# EAGLE design JBC_Station_V4 (EAGLE 7.7.0)
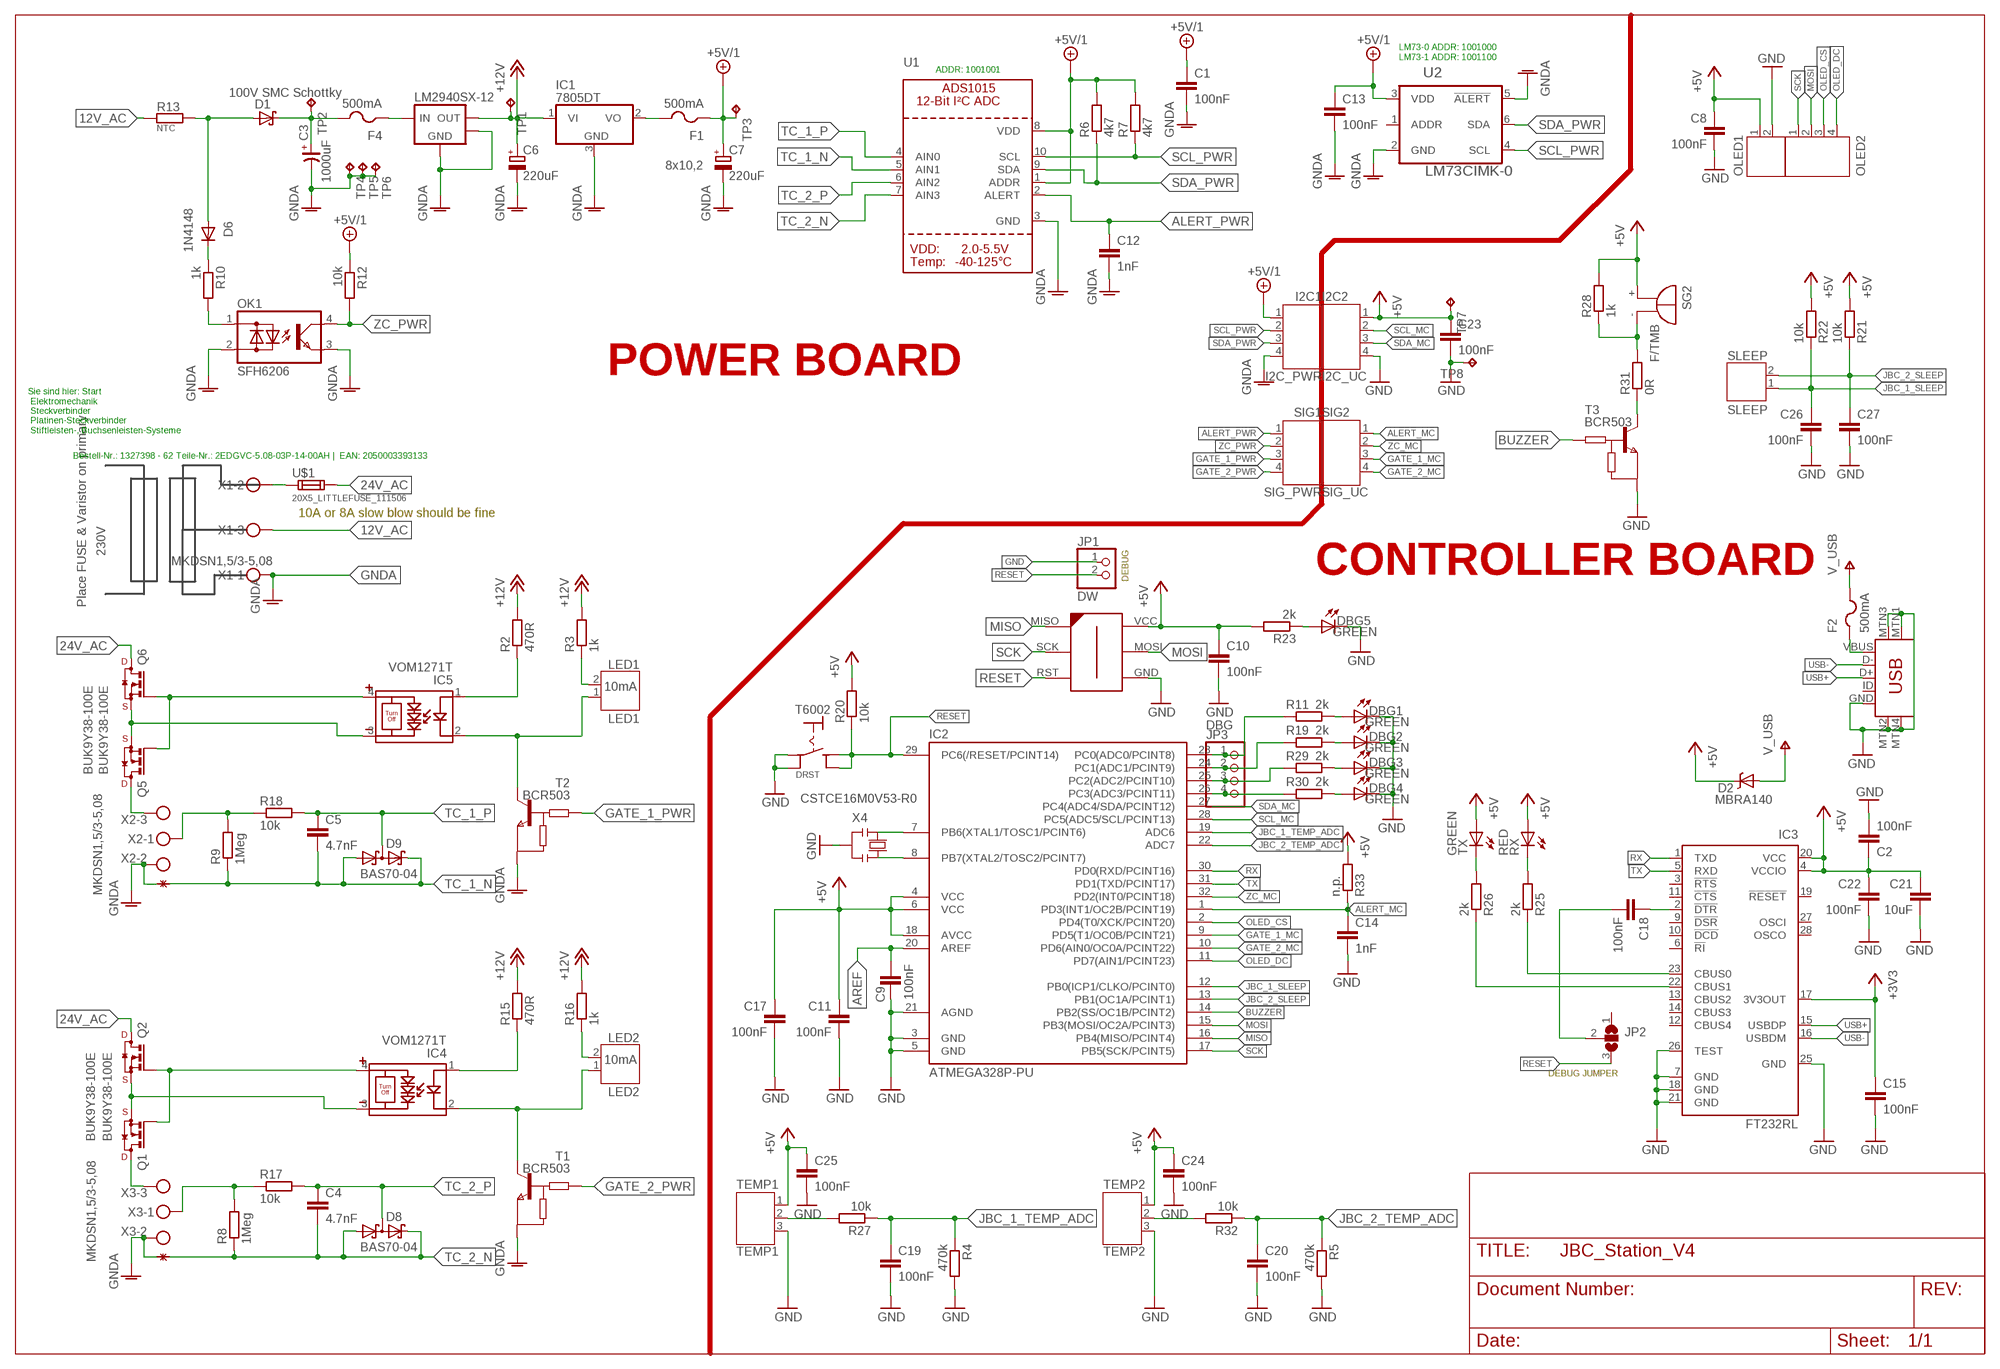
[diagram p0: schematic, sheet 1]

## Parts
C1  100nF  C-EUC0805  [C0805]
C2  100nF  C-EUC0805  [C0805]
C3  1000uF  CP_SV-H  [CSV-H]
C4  4.7nF  C-EUC0805  [C0805]
C5  4.7nF  C-EUC0805  [C0805]
C6  220uF  CPOL-EUE  [PANASONIC_E]
C7  220uF  CPOL-EUE  [PANASONIC_E]
C8  100nF  C-EUC0805  [C0805]
C9  100nF  C-EUC0805  [C0805]
C10  100nF  C-EUC0805  [C0805]
C11  100nF  C-EUC0805  [C0805]
C12  1nF  C-EUC0805  [C0805]
C13  100nF  C-EUC0805  [C0805]
C14  1nF  C-EUC0805  [C0805]
C15  100nF  C-EUC0805  [C0805]
C17  100nF  C-EUC0805  [C0805]
C18  100nF  C-EUC0805  [C0805]
C19  100nF  C-EUC0805  [C0805]
C20  100nF  C-EUC0805  [C0805]
C21  10uF  C-EUC1210  [C1210]
C22  100nF  C-EUC0805  [C0805]
C23  100nF  C-EUC0805  [C0805]
C24  100nF  C-EUC0805  [C0805]
C25  100nF  C-EUC0805  [C0805]
C26  100nF  C-EUC0805  [C0805]
C27  100nF  C-EUC0805  [C0805]
D1  100V SMC Schottky  SCHOTTKY-DIODESMC  [SMC]
D2  MBRA140  DIODE-SCHOTTKY_  [SMA-DIODE]
D6  1N4148  DIODE-MINIMELF  [MINIMELF]
D8  BAS70-04  [SOT23]
D9  BAS70-04  [SOT23]
DBG1  GREEN  LEDCHIP-LED0603  [CHIP-LED0603]
DBG2  GREEN  LEDCHIP-LED0603  [CHIP-LED0603]
DBG3  GREEN  LEDCHIP-LED0603  [CHIP-LED0603]
DBG4  GREEN  LEDCHIP-LED0603  [CHIP-LED0603]
DBG5  GREEN  LEDCHIP-LED0603  [CHIP-LED0603]
F1  500mA  PTCFUSE-1206  [R1206]
F2  500mA  PTCFUSE-1206  [R1206]
F4  500mA  PTCFUSE-1206  [R1206]
I2C1  I2C_PWR  JST-PH4  [JST-PH4]
I2C2  I2C_UC  JST-PH4  [JST-PH4]
IC1  7805DT  [TO252]
IC2  ATMEGA328P-PU  MEGA48/88/168-AU  [TQFP32-08]
IC3  FT232RL  [SSOP28]
IC4  VOM1271T  [SOP-4]
IC5  VOM1271T  [SOP-4]
JP1  DW  PINHD-1X2_2.54  [1X02]
JP2  SJ2W  [SJ_2]
JP3  DBG  PINHD-1X4/90  [1X04/90]
LED1  LED1  JST-PH2  [JST-PH2]
LED2  LED2  JST-PH2  [JST-PH2]
LM2940SX-12  LM2940KTT  [TO263-3]
OK1  SFH6206  [DIL4-SMD]
OLED1  JST-PH2  [JST-PH2]
OLED2  JST-PH4  [JST-PH4]
Q1  BUK9Y38-100E  [SOT669-POWERPAK-SO-8L-SINGLE]
Q2  BUK9Y38-100E  [SOT669-POWERPAK-SO-8L-SINGLE]
Q5  BUK9Y38-100E  [SOT669-POWERPAK-SO-8L-SINGLE]
Q6  BUK9Y38-100E  [SOT669-POWERPAK-SO-8L-SINGLE]
R2  470R  R-EU_R0805  [R0805]
R3  1k  R-EU_R0805  [R0805]
R4  470k  R-EU_R0805  [R0805]
R5  470k  R-EU_R0805  [R0805]
R6  4k7  R-EU_R0805  [R0805]
R7  4k7  R-EU_R0805  [R0805]
R8  1Meg  R-EU_R0805  [R0805]
R9  1Meg  R-EU_R0805  [R0805]
R10  1k  R-EU_R0805  [R0805]
R11  2k  R-EU_R0805  [R0805]
R12  10k  R-EU_R0805  [R0805]
R13  NTC  SQMR7  [SQM-VERTICAL-7W]
R15  470R  R-EU_R0805  [R0805]
R16  1k  R-EU_R0805  [R0805]
R17  10k  R-EU_R0805  [R0805]
R18  10k  R-EU_R0805  [R0805]
R19  2k  R-EU_R0805  [R0805]
R20  10k  R-EU_R0805  [R0805]
R21  10k  R-EU_R0805  [R0805]
R22  10k  R-EU_R0805  [R0805]
R23  2k  R-EU_R0805  [R0805]
R25  2k  R-EU_R0805  [R0805]
R26  2k  R-EU_R0805  [R0805]
R27  10k  R-EU_R0805  [R0805]
R28  1k  R-EU_R0805  [R0805]
R29  2k  R-EU_R0805  [R0805]
R30  2k  R-EU_R0805  [R0805]
R31  0R  R-EU_R0805  [R0805]
R32  10k  R-EU_R0805  [R0805]
R33  n.p.  R-EU_R0805  [R0805]
RX  RED  LEDCHIP-LED0603  [CHIP-LED0603]
SG2  F/TMB  [F/TMB]
SIG1  SIG_PWR  JST-PH4  [JST-PH4]
SIG2  SIG_UC  JST-PH4  [JST-PH4]
SLEEP  SLEEP  JST-PH2  [JST-PH2]
T1  BCR503  GM4_BIP_NPN-DIG_SOT23_RZ  [GM4_BIP_SOT23_RZ]
T2  BCR503  GM4_BIP_NPN-DIG_SOT23_RZ  [GM4_BIP_SOT23_RZ]
T3  BCR503  GM4_BIP_NPN-DIG_SOT23_RZ  [GM4_BIP_SOT23_RZ]
T6002  DRST  TASTE_DRST_TA1  [TASTE_DRST_TA1]
TEMP1  TEMP1  JST-PH3  [JST-PH3]
TEMP2  TEMP2  JST-PH3  [JST-PH3]
TP1  TPTP17R  [TP17R]
TP2  TPTP17R  [TP17R]
TP3  TPTP17R  [TP17R]
TP4  TPTP17R  [TP17R]
TP5  TPTP17R  [TP17R]
TP6  TPTP17R  [TP17R]
TP7  TPTP17R  [TP17R]
TP8  TPTP17R  [TP17R]
TX  GREEN  LEDCHIP-LED0603  [CHIP-LED0603]
U1  ADC_ADS1015  [MSOP10]
U2  LM73CIMK-0  [SOT95P285X100-6N]
U$1  20X5_LITTLEFUSE_111506  [20X5_LITTLEFUSE_111506]
U$2  STARPONT  [STARPOINT]
U$3  STARPONT  [STARPOINT]
U$5  AVR-ISP-6-EDGE  [6PAD_ISP]
USB  USB-MINIB-5PIN  [USB-MINIB]
X1  MKDSN1,5/3-5,08  [MKDSN1,5/3-5,08]
X2  MKDSN1,5/3-5,08  [MKDSN1,5/3-5,08]
X3  MKDSN1,5/3-5,08  [MKDSN1,5/3-5,08]
X4  CSTCE16M0V53-R0  0011_CSTCE16M0V53-R0  [RESONATOR]

## Nets
12V_AC: R13.P$1 X1.3
12V_AC_PROT: D1.A D6.A R13.P$2
24V_AC: Q2.5(D) Q6.5(D) U$1.21 U$1.22
+3V3: C15.1 IC3.17(3V3OUT)
+5V: C2.1 C8.1 C10.1 C11.1 C17.1 C21.1 C22.1 C23.1 C24.1 C25.1 D2.C I2C2.1 IC2.4(VCC) IC2.6(VCC) IC2.18(AVCC) IC3.4(VCCIO) IC3.20(VCC) OLED1.1 R20.2 R21.2 R22.2 R23.2 R28.2 R33.2 RX.A SG2.+ TEMP1.1 TEMP2.1 TP7.TP TX.A U$5.VCC
+5V/1: C1.1 C7.+ C13.1 F1.1 I2C1.1 R6.2 R7.2 R12.1 TP3.TP U1.1(ADDR) U1.8(VDD) U2.3(VDD)
+12V: C6.+ IC1.1(VI) LM2940SX-12.3(VOUT) R2.2 R3.2 R15.2 R16.2 TP1.TP
ALERT_MC: C14.1 IC2.1(PD3(INT1/OC2B/PCINT19)) R33.1 SIG2.1
ALERT_PWR: C12.1 SIG1.1 U1.2(ALERT)
AREF: C9.1 IC2.20(AREF)
BUZZER: IC2.14(PB2(SS/OC1B/PCINT2)) T3.1(B)
DBG1: IC2.23(PC0(ADC0/PCINT8)) JP3.1 R11.2
DBG2: IC2.24(PC1(ADC1/PCINT9)) JP3.2 R19.2
DBG3: IC2.25(PC2(ADC2/PCINT10)) JP3.3 R29.2
DBG4: IC2.26(PC3(ADC3/PCINT11)) JP3.4 R30.2
GATE_1_MC: IC2.9(PD5(T1/OC0B/PCINT21)) SIG2.3
GATE_1_PWR: SIG1.3 T2.1(B)
GATE_2_MC: IC2.10(PD6(AIN0/OC0A/PCINT22)) SIG2.4
GATE_2_PWR: SIG1.4 T1.1(B)
GND: C2.2 C8.2 C9.2 C10.2 C11.2 C14.2 C15.2 C17.2 C19.2 C20.2 C21.2 C22.2 C23.2 C24.2 C25.2 C26.2 C27.2 DBG1.C DBG2.C DBG3.C DBG4.C DBG5.C I2C2.4 IC2.3(GND) IC2.5(GND) IC2.21(AGND) IC3.7(GND) IC3.18(GND) IC3.21(GND) IC3.25(GND) IC3.26(TEST) JP1.1 OLED1.2 R4.2 R5.2 T3.2(E) T6002.P$1 T6002.P$2 TEMP1.3 TEMP2.3 TP8.TP U$5.GND USB.GND USB.MTN1(MTN2) USB.MTN2(MTN3) USB.MTN3(MTN1) USB.MTN4 X4.2
GNDA: C1.2 C3.- C6.- C7.- C12.2 C13.2 I2C1.4 IC1.3(GND) LM2940SX-12.2(GND) LM2940SX-12.TAB OK1.2(AC2) OK1.3(E) T1.2(E) T2.2(E) TP4.TP TP5.TP TP6.TP U1.3(GND) U2.2(GND) U2.5(!ALERT!) U$2.P$2 U$3.P$2 X1.1 X2.2 X3.2
JBC_1_SLEEP: C26.1 IC2.12(PB0(ICP1/CLKO/PCINT0)) R22.1 SLEEP.1
JBC_1_TEMP_ADC: C19.1 IC2.19(ADC6) R4.1 R27.1
JBC_2_SLEEP: C27.1 IC2.13(PB1(OC1A/PCINT1)) R21.1 SLEEP.2
JBC_2_TEMP_ADC: C20.1 IC2.22(ADC7) R5.1 R32.1
MISO: IC2.16(PB4(MISO/PCINT4)) U$5.MISO
MOSI: IC2.15(PB3(MOSI/OC2A/PCINT3)) OLED2.2 U$5.MOSI
N$2: IC5.4 Q5.4(G) Q6.4(G)
N$3: LED1.2 R3.1
N$4: IC5.2 LED1.1 T2.3(C)
N$5: IC5.1 R2.1
N$6: IC2.7(PB6(XTAL1/TOSC1/PCINT6)) X4.1
N$7: IC4.4 Q1.4(G) Q2.4(G)
N$8: Q5.5(D) X2.3
N$9: OK1.1(AC1) R10.2
N$10: Q1.5(D) X3.3
N$11: R9.2 R18.1 X2.1
N$12: C3.+ D1.C F4.2 TP2.TP
N$13: R8.2 R17.1 X3.1
N$14: IC5.3 Q5.1(S) Q5.2(S) Q5.3(S) Q6.1(S) Q6.2(S) Q6.3(S)
N$15: IC4.3 Q1.1(S) Q1.2(S) Q1.3(S) Q2.1(S) Q2.2(S) Q2.3(S)
N$17: IC4.2 LED2.1 T1.3(C)
N$18: IC4.1 R15.1
N$19: IC2.8(PB7(XTAL2/TOSC2/PCINT7)) X4.3
N$20: LED2.2 R16.1
N$21: U$1.11 U$1.12 X1.2
N$23: D6.C R10.1
N$24: C18.2 JP2.2
N$25: C18.1 IC3.2(!DTR)
N$26: F1.2 IC1.2(VO)
N$27: DBG5.A R23.1
N$29: IC3.23(CBUS0) R25.1
N$30: IC3.22(CBUS1) R26.1
N$31: R25.2 RX.C
N$32: F2.1 USB.VBUS
N$33: R26.2 TX.C
N$35: R27.2 TEMP1.2
N$37: R28.1 R31.2 SG2.-
N$38: DBG1.A R11.1
N$39: F4.1 LM2940SX-12.1(VIN)
N$40: DBG2.A R19.1
N$41: DBG3.A R29.1
N$42: DBG4.A R30.1
N$46: R31.1 T3.3(C)
N$47: R32.2 TEMP2.2
OLED_CS: IC2.2(PD4(T0/XCK/PCINT20)) OLED2.3
OLED_DC: IC2.11(PD7(AIN1/PCINT23)) OLED2.4
RESET: IC2.29(PC6(/RESET/PCINT14)) JP1.2 JP2.3 R20.1 T6002.P$3 T6002.P$4 U$5.RST
RX: IC2.30(PD0(RXD/PCINT16)) IC3.1(TXD)
SCK: IC2.17(PB5(SCK/PCINT5)) OLED2.1 U$5.SCK
SCL_MC: I2C2.2 IC2.28(PC5(ADC5/SCL/PCINT13))
SCL_PWR: I2C1.2 R7.1 U1.10(SCL) U2.4(SCL)
SDA_MC: I2C2.3 IC2.27(PC4(ADC4/SDA/PCINT12))
SDA_PWR: I2C1.3 R6.1 U1.9(SDA) U2.6(SDA)
TC_1_N: C5.2 D9.1(A1) D9.2(C2) R9.1 U1.5(AIN1) U$2.P$1
TC_1_P: C5.1 D9.3(C1A2) R18.2 U1.4(AIN0)
TC_2_N: C4.2 D8.1(A1) D8.2(C2) R8.1 U1.7(AIN3) U$3.P$1
TC_2_P: C4.1 D8.3(C1A2) R17.2 U1.6(AIN2)
TX: IC2.31(PD1(TXD/PCINT17)) IC3.5(RXD)
USB+: IC3.15(USBDP) USB.D+
USB-: IC3.16(USBDM) USB.D-
V+: D2.A F2.2 ; supply symbol labelled V_USB
ZC_MC: IC2.32(PD2(INT0/PCINT18)) SIG2.2
ZC_PWR: OK1.4(C) R12.2 SIG1.2
Unconnected: IC3.3(!RTS) IC3.6(!RI) IC3.9(!DSR) IC3.10(!DCD) IC3.11(!CTS) IC3.12(CBUS4) IC3.13(CBUS2) IC3.14(CBUS3) IC3.19(!RESET) IC3.27(OSCI) IC3.28(OSCO) JP2.1 U2.1(ADDR) USB.ID

## Notes on the sheet
- LM73-0 ADDR: 1001000
  LM73-1 ADDR: 1001100
- ADDR: 1001001
- 8x10,2
- POWER BOARD
- Sie sind hier: Start 
   Elektromechanik 
   Steckverbinder 
   Platinen-Steckverbinder 
   Stiftleisten-, Buchsenleisten-Systeme
- Bestell-Nr.: 1327398 - 62 Teile-Nr.: 2EDGVC-5.08-03P-14-00AH |  EAN: 2050003393133
- 10A or 8A slow blow should be fine
- 230V
- CONTROLLER BOARD
- DEBUG
- Place FUSE & Varistor on primary
- 10mA
- 10mA
- DEBUG JUMPER

## Library data of the parts
C1 C2 C4 C5 C8-C15 C17-C27 = rcl:C-EU: CAPACITOR, European symbol
C3 = rc-master-smd:CP_: POLARIZED CAP
C6 C7 = rcl:CPOL-EU: POLARIZED CAPACITOR, European symbol
D1 = diode:SCHOTTKY-DIODE: Schottky Diode
D2 = SparkFun:DIODE-SCHOTTKY
D6 = diode:DIODE-: DIODE
D8 D9 = diode:BAS70-04: Silicon Schottky Diodes General-purpose diode for high-speed switching
DBG1-DBG5 RX TX = led:LED: LED OSRAM: - CHIPLED LG R971, LG N971, LY N971, LG Q971, LY Q971, LO R971, LY R971 LH N974, LH R974 LS Q976, LO Q976, LY Q976 LO Q996 - Hyper CHIPLED LW Q18S LB Q993, LB Q99A, LB R99A - SideLED LS A670, LO A670, LY A670, LG A670, LP A670 LB A673, LV A673, LT A673, LW A673 LH A674 LY A675 LS A676, LA A676, LO A676, LY A676, LW A676 LS A679, LY A679, LG A679 - Hyper Micro SIDELED® LS Y876, LA Y876, LO Y876, LY Y876 LT Y87S - SmartLED LW L88C, LW L88S LB L89C, LB L89S, LG L890 LS L89K, LO L89K, LY L89K LS L896, LA L896, LO L896, LY L896 - TOPLED LS T670, LO T670, LY T670, LG T670, LP T670 LSG T670, LSP T670, LSY T670, LOP T670, LYG T670 LG T671, LOG T671, LSG T671 LB T673, LV T673, LT T673, LW T673 LH T674 LS T676, LA T676, LO T676, LY T676, LB T676, LH T676, LSB T676, LW T676 LB T67C, LV T67C, LT T67C, LS T67K, LO T67K, LY T67K, LW E67C LS E67B, LA E67B, LO E67B, LY E67B, LB E67C, LV E67C, LT E67C LW T67C LS T679, LY T679, LG T679 LS T770, LO T770, LY T770, LG T770, LP T770 LB T773, LV T773, LT T773, LW T773 LH T774 LS E675, LA E675, LY E675, LS T675 LS T776, LA T776, LO T776, LY T776, LB T776 LHGB T686 LT T68C, LB T68C - Hyper Mini TOPLED® LB M676 - Mini TOPLED Santana® LG M470 LS M47K, LO M47K, LY M47K Source: http://www.osram.convergy.de LUXEON: - LUMILED® LXK2-PW12-R00, LXK2-PW12-S00, LXK2-PW14-U00, LXK2-PW14-V00 LXK2-PM12-R00, LXK2-PM12-S00, LXK2-PM14-U00 LXK2-PE12-Q00, LXK2-PE12-R00, LXK2-PE12-S00, LXK2-PE14-T00, LXK2-PE14-U00 LXK2-PB12-K00, LXK2-PB12-L00, LXK2-PB12-M00, LXK2-PB14-N00, LXK2-PB14-P00, LXK2-PB14-Q00 LXK2-PR12-L00, LXK2-PR12-M00, LXK2-PR14-Q00, LXK2-PR14-R00 LXK2-PD12-Q00, LXK2-PD12-R00, LXK2-PD12-S00 LXK2-PH12-R00, LXK2-PH12-S00 LXK2-PL12-P00, LXK2-PL12-Q00, LXK2-PL12-R00 Source: www.luxeon.com KINGBRIGHT: KA-3528ASYC Source: www.kingbright.com
F1 F2 F4 = adafruit:PTCFUSE: PTC fuses, resettable thermistors
I2C1 I2C2 OLED2 SIG1 SIG2 = jst-ph:JST-PH4
IC1 = linear:78*: Positive VOLTAGE REGULATOR Source: http://cache.national.com/ds/LM/LM78L05.pdf http://www.fairchildsemi.com/ds/LM/LM7805.pdf
IC2 = avr-6:MEGA48/88/168
IC3 = ftdichip:FT232R: Source: http://www.ftdichip.com/Documents/DataSheets/DS_FT232R_v104.pdf; MPN: FT232RL; OC_FARNELL: 1146032; OC_NEWARK: 91K9918
IC4 IC5 = eigene_lib:VOM1271T
JP1 = pinhead_SMD:PINHD-1X2: PIN HEADER
JP2 = jumper:SJ2W: SMD solder JUMPER
JP3 = pinhead:PINHD-1X4: PIN HEADER
LED1 LED2 OLED1 SLEEP = jst-ph:JST-PH2
LM2940SX-12 = bt_regulator:LM2940: LM2940 LDO Voltage Regulator Input Voltage Range = 6 V to 26 V Dropout Voltage Typically 0.5 V at IOUT = 1 A Reverse Battery Protection Internal Short Circuit Current Limit electrostatic discharge protection (±2kV) Tab is GND The LM2940-N/LM2940C positive voltage regulator features the ability to source 1A of output current with a dropout voltage of typically 0.5V and a maximum of 1V over the entire temperature range. Furthermore, a quiescent current reduction circuit has been included which reduces the ground current when the differential between the input voltage and the output exceeds approximately 3V. Designed also for vehicular applications, the LM2940-N/LM2940C and all regulated circuitry are protected from reverse battery installations or 2-battery jumps. During line transients, such as load dump when the input voltage can momentarily exceed the specified maximum operating voltage, the regulator will automatically shut down to protect both the internal circuits and the load. The LM2940/LM2940C cannot be harmed by temporary mirror-image insertion. Familiar regulator features such as short circuit and thermal overload protection are also provided. Datasheet.pdf <http://www.ti.com/lit/ds/symlink/lm2940-n.pdf>
OK1 = optocoupler:SFH620: Optocoupler, Phototransistor Output, AC Input Source: http://www.vishay.com/docs/83675/sfh620.pdf; MF: VISHAY/TELEFUNKEN; MPN: SFH6206-3; OC_FARNELL: 1469585; OC_NEWARK: 58K2214
Q1 Q2 Q5 Q6 = 01_eigene_lib:BUK9Y38-100E: Alternative Package Names: LFPAK56 SOT669 PowerPak SO-8L SINGLE
R2-R12 R15-R23 R25-R33 = rcl:R-EU_: RESISTOR, European symbol
R13 = Phil_lib_6.5_Conti_02:SQMR7
SG2 = buzzer:F/TMB: BUZZER Source: Buerklin; OC_FARNELL: unknown; OC_NEWARK: unknown
T1-T3 = PFC_Power_v4:GM4_BIP_NPN-DIG: NPN Digitaltransistor wie BCR148
T6002 = Phil VCX60 2012_Apr:TASTE_DRST_TA1
TEMP1 TEMP2 = jst-ph:JST-PH3
TP1-TP8 = testpad:TP: Test pad
U1 = microbuilder2:ADC_ADS1015: ADS1015 - 12-bit 4-Channel I2C ADC with Internal PGA VDD: 2.0-5.5V Sampling Rate: 3.3ksps Gain Settings: 2/3, 1, 2, 4, 8, 16 I2C Address: ADDR low = 1001000x, ADDR high = 1001001x Internal Comparator The ADS1015 includes an internal comparator that can be set to output a high-level on ALERT when the conversion results exceeeds a pre-defined upper level, and will deassert itself when the level falls below a pre-defined lower threshold level. It can also be set to windowed mode where the ALERT pin will be asserted if the data exceeds the upper threshold or falls below the lower threshold.
U2 = LM73:LM73CIMK-0: Digital Temperature Sensor; MPN: LM73CIMK-0; OC_FARNELL: 1312598; OC_NEWARK: 69K2606; PACKAGE: SOT-23-6; SUPPLIER: National Semiconductor
U$1 = 01_eigene_lib:20X5_LITTLEFUSE_111506: Littlefuse 111 506
U$2 U$3 = eigene_lib:STARPONT
U$5 = avr-6:AVR-ISP-6-EDGE: 6 pin edge connector for ISP with ATMEL MCUs. Developed by Craig Moates (craig at moates dot net). Library by David Blundell (blundar at gmail dot com). Often, even a 6 pin header is really inconvenient for board layout and/or production. This SMD-only header is our de-facto standard for using an edge connector for programming with the help of a 6pin/10pin to edge card adapter.
USB = SparkFun:USB-MINIB: Mini-USB "B" connector with 5th pin broken out. Created new symbol breaking out 5th "ID" pin in mini/micro USB connector spec. See: http://en.wikipedia.org/wiki/Mini_usb#Cables. Uses same footprint as 4-pin symbol. Also added pins to connect to mounting / shield pads if required (probably not generally needed as signals aren't shielded once they leave the connector).
X1-X3 = con-phoenix-508:MKDSN1,5/3-5,08: MKDSN 1,5/ 3-5,08 Printklemme Nennstrom: 13,5 A Nennspannung: 250 V Rastermaß: 5,08 mm Polzahl: 3 Anschlussart: Schraubanschluss Montage: Löten Anschlussrichtung Leiter/Platine: 0 ° Artikelnummer: 1729131 Source: http://eshop.phoenixcontact.com .. 1729131.pdf
X4 = NanoV3.2:0011_CSTCE16M0V53-R0: 16Mhz - SMD; MONTHLY_USAGE: _____; PART_NUMBER: CSTCE16M0V53-R0; PRICE: _____; SUPPLIER: _____; TYPE: Cristalli

## Board
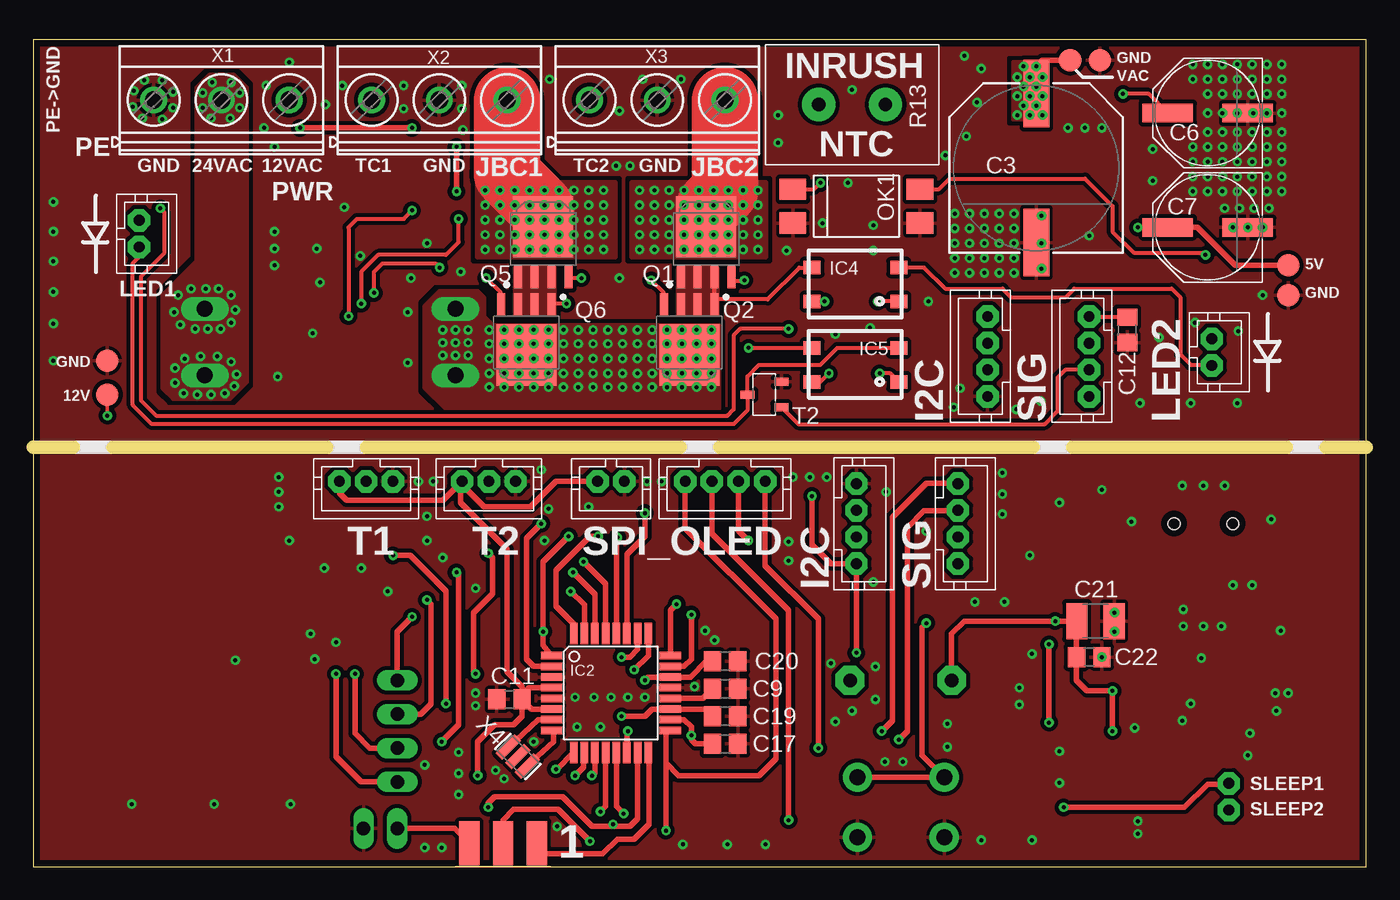
[diagram p1: board, top side]
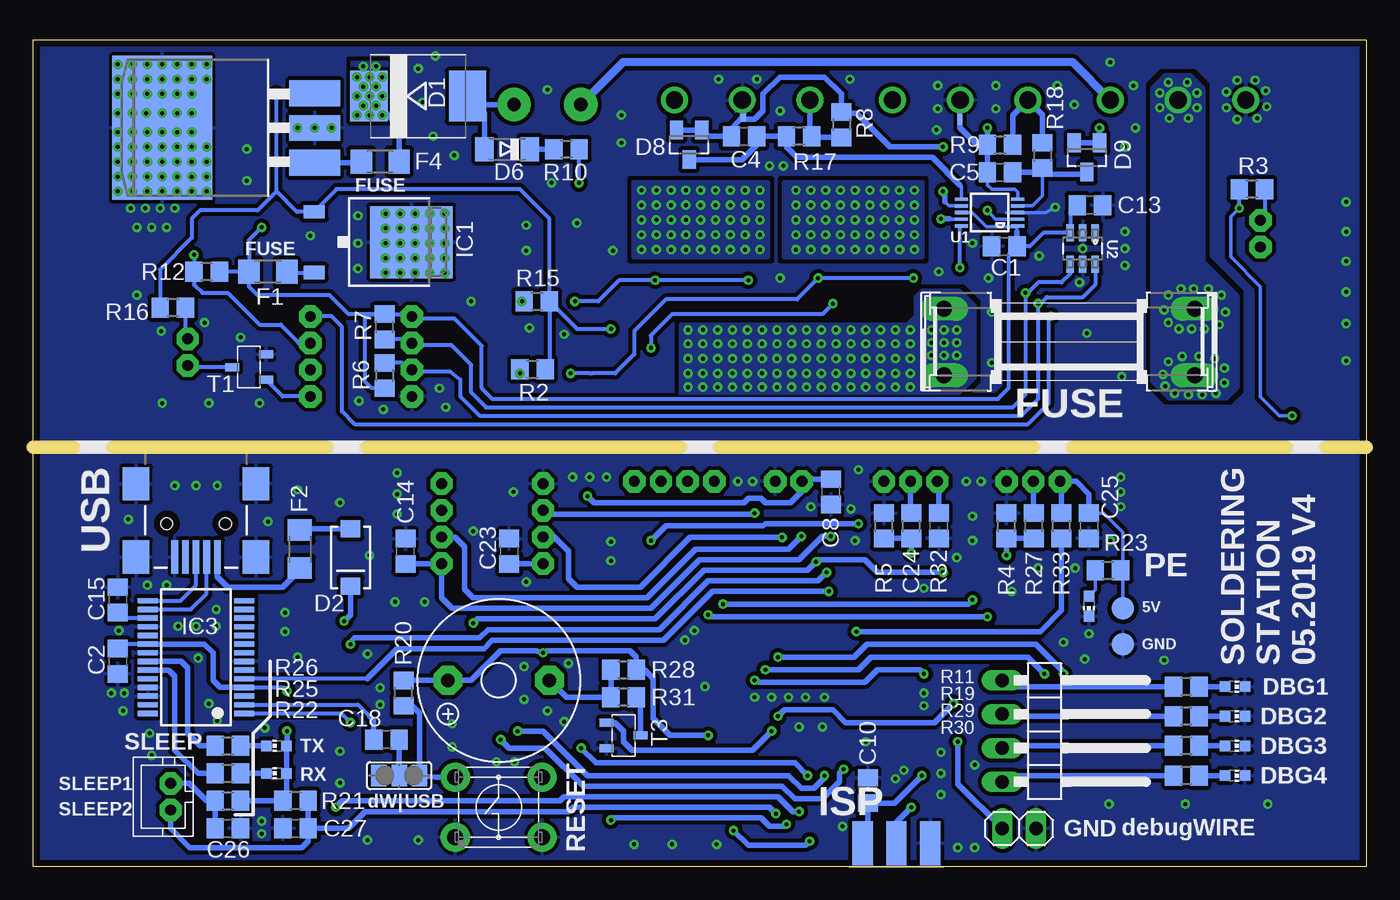
[diagram p2: board, bottom side, seen from below]

Size 100 x 62 mm. Coordinates in mm from the lower left corner, seen from the top.
Outline: 0,0 100,0 100,62 0,62 0,0
Copper layers (1*16): Top 0.035mm / dielectric 1.6mm / Bottom 0.035mm
Design rules "Elecrow_2-layer_PCB_eagle_rule": minimum track width 6mil, minimum drill 0.3mm, track to track 6mil, track to pad 8mil, pad to pad 12mil, via to via 12mil, smd to smd 0mil, copper to edge 20mil, drill to drill 10mil, minimum pad ring 6mil, minimum via ring 6mil, stop-mask expansion 0mil, vias tented up to drill 100mil, thermal gap 10mil
Milling: 6 lines

### Footprints (pad centres in the part's own frame; a part is rotated, then mirrored left to right if it is on the bottom)
C0805 = smd 1.3 x 1.5: 1 -0.95,0; 2 0.95,0
CSV-H = smd 5.08 x 1.93: + -5.588,0; - 5.588,0
PANASONIC_E = smd 3.8 x 1.4: + 3,0; - -3,0
C1210 = smd 1.6 x 2.7: 1 -1.4,0; 2 1.4,0
SMC = smd 2.8 x 3.8: A 3.7,0; C -3.7,0
SMA-DIODE = smd 1.27 x 1.47: A -2.15,0; C 2.15,0
MINIMELF = smd 1.4 x 1.8: A 1.7,0; C -1.7,0
SOT23 = smd 1 x 1.4: 1 -0.95,-1.1; 2 0.95,-1.1; 3 0,1.1
CHIP-LED0603 = smd 0.8 x 0.8: A 0,-0.75; C 0,0.75
R1206 = smd 1.6 x 1.803: 1 -1.422,0; 2 1.422,0
JST-PH4 = drill 0.813 pad 1.676 octagon: 1 3,0; 2 1,0; 3 -1,0; 4 -3,0
TO252 = smd 1 x 1.6: 1 -2.28,-4.8; 2 2.28,-4.8 | smd 5.4 x 6.2: 3 0,2.5
TQFP32-08 = smd 1.6 x 0.559: 1 -4.451,2.8; 2 -4.451,2; 3 -4.451,1.2; 4 -4.451,0.4; 5 -4.451,-0.4; 6 -4.451,-1.2; 7 -4.451,-2; 8 -4.451,-2.8; 17 4.451,-2.8; 18 4.451,-2; 19 4.451,-1.2; 20 4.451,-0.4; 21 4.451,0.4; 22 4.451,1.2; 23 4.451,2; 24 4.451,2.8 | smd 0.559 x 1.6: 9 -2.8,-4.451; 10 -2,-4.451; 11 -1.2,-4.451; 12 -0.4,-4.451; 13 0.4,-4.451; 14 1.2,-4.451; 15 2,-4.451; 16 2.8,-4.451; 25 2.8,4.451; 26 2,4.451; 27 1.2,4.451; 28 0.4,4.451; 29 -0.4,4.451; 30 -1.2,4.451; 31 -2,4.451; 32 -2.8,4.451
SSOP28 = smd 0.4 x 1.5: 1 -4.225,-3.625; 2 -3.575,-3.625; 3 -2.925,-3.625; 4 -2.275,-3.625; 5 -1.625,-3.625; 6 -0.975,-3.625; 7 -0.325,-3.625; 8 0.325,-3.625; 9 0.975,-3.625; 10 1.625,-3.625; 11 2.275,-3.625; 12 2.925,-3.625; 13 3.575,-3.625; 14 4.225,-3.625; 15 4.225,3.625; 16 3.575,3.625; 17 2.925,3.625; 18 2.275,3.625; 19 1.625,3.625; 20 0.975,3.625; 21 0.325,3.625; 22 -0.325,3.625; 23 -0.975,3.625; 24 -1.625,3.625; 25 -2.275,3.625; 26 -2.925,3.625; 27 -3.575,3.625; 28 -4.225,3.625
SOP-4 = smd 1.27 x 1: 1 -3.175,1.27; 2 -3.175,-1.27; 3 3.325,-1.27; 4 3.325,1.27
1X02 = drill 1.016 long: 1 -1.27,0; 2 1.27,0
SJ_2 = smd 1.168 x 1.6: 1 -1.524,0; 2 0,0; 3 1.524,0
1X04/90 = drill 1.016 long: 1 -3.81,-3.81; 2 -1.27,-3.81; 3 1.27,-3.81; 4 3.81,-3.81
JST-PH2 = drill 0.813 pad 1.676 octagon: 1 1,0; 2 -1,0
TO263-3 = smd 1.93 x 3.81: 1 -2.611,-7.624; 2 -0.007,-7.626; 3 2.597,-7.628 | smd 10.795 x 7.493: TAB 0,3.81
DIL4-SMD = smd 1.6 x 2: 1 -1.27,-4.77; 2 1.27,-4.77; 3 1.27,4.77; 4 -1.27,4.77
SOT669-POWERPAK-SO-8L-SINGLE = smd 1.65 x 0.6: 1 -2.65,1.905; 2 -2.65,0.635; 3 -2.65,-0.635; 4 -2.65,-1.905 | smd 4.6 x 4.5: 5 1.15,0
R0805 = smd 1.3 x 1.5: 1 -0.95,0; 2 0.95,0
SQM-VERTICAL-7W = drill 1 pad 2.5: P$1 2.5,0; P$2 -2.5,0
F/TMB = drill 1.016 pad 2.159 octagon: + 3.81,0; - -3.81,0
GM4_BIP_SOT23_RZ = smd 0.6 x 1.05: 1 -0.953,-1.27; 2 0.953,-1.27; 3 0,1.27
TASTE_DRST_TA1 = drill 1.2 pad 2.184: P$1 -2.25,3.25; P$2 -2.25,-3.25; P$3 2.25,-3.25; P$4 2.25,3.25
JST-PH3 = drill 0.813 pad 1.676 octagon: 1 1.005,0; 2 -1,0; 3 -3,0
TP17R = smd 1.7 x 1.7: TP 0,0
MSOP10 = smd 0.25 x 1: 1 -1,-2.113; 2 -0.5,-2.113; 3 0,-2.113; 4 0.5,-2.113; 5 1,-2.113; 6 1,2.113; 7 0.5,2.113; 8 0,2.113; 9 -0.5,2.113; 10 -1,2.113
SOT95P285X100-6N = smd 1.27 x 0.559: 1 -1.168,0.94; 2 -1.168,0; 3 -1.168,-0.94; 4 1.168,-0.94; 5 1.168,0; 6 1.168,0.94
20X5_LITTLEFUSE_111506 = drill 1.2 long: 11 -9.668,2.539; 12 -9.668,-2.461; 21 9.128,-2.461; 22 9.128,2.539
STARPOINT = smd 0.813 x 0.406: P$1 -0.159,0; P$2 0.159,0
6PAD_ISP = smd 1.524 x 3.302 bottom: GND 2.54,0; MOSI 0,0; VCC -2.54,0 | smd 1.524 x 3.302: MISO -2.54,0; RST 2.54,0; SCK 0,0
USB-MINIB = smd 2.5 x 0.5: D+ 2.5,0; D- 2.5,0.8; GND 2.5,-1.6; ID 2.5,-0.8; VBUS 2.5,1.6 | smd 2.5 x 2: MTN1 -3,4.5; MTN2 2.5,4.5; MTN3 -3,-4.5; MTN4 2.5,-4.5 | hole 0.9: 0,2.2; 0,-2.2
MKDSN1,5/3-5,08 = drill 1.3 pad 2: 1 -7.641,0.025; 2 -2.561,0.025; 3 2.519,0.025
RESONATOR = smd 0.7 x 2: 1 -1,0; 2 0,0; 3 1,0

### Placement (x,y rotation side)
C1  27.15,46.51 180 bottom
C2  93.66,15.4 270 bottom
C3  75.25,52.39 270 top
C4  46.67,54.77 180 bottom
C5  27.46,52.07 180 bottom
C6  88.11,56.52 180 top
C7  88.11,47.94 180 top
C8  40.16,28.1 270 bottom
C9  51.91,13.34 0 top
C10  37.39,5.71 90 bottom
C11  35.72,12.54 180 top
C12  82.07,40.24 270 top
C13  20.72,49.61 0 bottom
C14  72.07,23.65 90 bottom
C15  93.66,20 90 bottom
C17  51.91,9.21 0 top
C18  73.5,9.53 0 bottom
C19  51.91,11.27 0 top
C20  51.91,15.4 0 top
C21  79.69,18.41 0 top
C22  79.22,15.72 0 top
C23  64.29,23.65 90 bottom
C24  32.07,25.56 270 bottom
C25  20.8,25.56 270 bottom
C26  85.41,2.86 0 bottom
C27  80.33,2.86 180 bottom
D1  71.12,57.78 0 bottom
D2  76.2,23.18 270 bottom
D6  64.45,53.82 180 bottom
D8  50.8,54.13 180 bottom
D9  20.95,53.18 180 bottom
DBG1  9.84,13.49 270 bottom
DBG2  9.84,11.27 270 bottom
DBG3  9.84,9.05 270 bottom
DBG4  9.84,6.83 270 bottom
DBG5  20.8,19.53 180 bottom
F1  82.39,44.61 0 bottom
F2  80.01,23.81 90 bottom
F4  73.98,52.86 0 bottom
I2C1  71.6,38.26 90 top
I2C2  61.75,25.72 270 top
IC1  74.14,46.83 270 bottom
IC2  43.34,13.02 0 top
IC3  87.79,15.72 90 bottom
IC4  61.75,43.66 180 top
IC5  61.75,37.62 180 top
JP1  26.04,2.86 180 bottom
JP2  72.55,6.83 0 bottom
JP3  23.5,10.16 270 bottom
LED1  7.94,47.47 270 top
LED2  88.42,38.58 270 top
LM2940SX-12  86.52,55.4 90 bottom
OK1  61.75,49.53 270 top
OLED1  43.34,28.89 180 top
OLED2  51.91,28.89 180 top
Q1  50.48,46.83 90 top
Q2  49.21,39.53 270 top
Q5  38.26,46.83 90 top
Q6  36.99,39.53 270 top
R2  62.55,37.31 0 bottom
R3  8.57,50.8 180 bottom
R4  26.99,25.56 90 bottom
R5  36.2,25.56 90 bottom
R6  73.66,36.83 270 bottom
R7  73.66,40.48 90 bottom
R8  39.37,55.64 270 bottom
R9  27.46,54.13 0 bottom
R10  60.01,53.82 0 bottom
R11  13.49,13.49 180 bottom
R12  87,44.61 180 bottom
R13  61.44,57.15 180 top
R15  62.23,42.39 0 bottom
R16  89.53,41.91 180 bottom
R17  42.55,54.77 180 bottom
R18  24.29,53.34 270 bottom
R19  13.49,11.27 180 bottom
R20  72.23,13.02 90 bottom
R21  80.33,4.92 180 bottom
R22  85.41,4.92 0 bottom
R23  19.37,22.23 0 bottom
R25  85.41,6.99 0 bottom
R26  85.41,9.05 0 bottom
R27  24.92,25.56 90 bottom
R28  55.72,14.76 0 bottom
R29  13.49,9.05 180 bottom
R30  13.49,6.83 180 bottom
R31  55.72,12.7 180 bottom
R32  34.13,25.56 90 bottom
R33  22.86,25.56 90 bottom
RX  81.76,6.99 90 bottom
SG2  65.09,13.97 180 bottom
SIG1  79.22,38.26 90 top
SIG2  69.37,25.72 270 top
SLEEP  89.69,5.24 90 bottom
T1  83.82,37.47 90 bottom
T2  54.85,35.4 90 top
T3  55.72,9.84 270 bottom
T6002  65.09,4.45 90 bottom
TEMP1  23.97,28.89 180 top
TEMP2  33.18,28.89 180 top
TP1  5.56,35.4 0 top
TP2  77.79,60.48 0 top
TP3  94.14,45.09 90 top
TP4  5.56,37.94 0 top
TP5  80.01,60.48 0 top
TP6  94.14,42.86 0 top
TP7  18.26,19.37 0 bottom
TP8  18.26,16.67 0 bottom
TX  81.76,9.05 90 bottom
U1  28.26,49.05 90 bottom
U2  21.27,46.35 270 bottom
U$1  22.54,39.37 180 bottom
U$2  30.48,56.2 90 bottom
U$3  46.75,56.44 90 bottom
U$5  35.24,1.75 180 top
USB  87.79,25.72 270 bottom
X1  16.67,57.47 0 top
X2  33.02,57.47 0 top
X3  49.37,57.47 0 top
X4  36.35,8.26 315 top

### Tracks (layer width: path | path; a pad name or v marks a point on that pad's centre or on a via)
12V_AC
  Bottom 0.4: 58.9,57.19 R13.P$1
  Bottom 0.61: X1.3 22.02,60.33 55.76,60.33 R13.P$1
12V_AC_PROT
  Bottom 0.4: R13.P$2 66.78,57.15 D1.A 66.15,56.52 D6.A
24V_AC  (via drill 0.3 pad 0.7)
  other vias: 35.32,35.96 40.88,35.96 39.77,35.96 38.66,35.96 37.54,35.96 36.43,35.96 35.32,36.99 40.88,36.99 39.77,36.99 38.66,36.99 37.54,36.99 36.43,36.99 35.32,38.1 40.88,38.1 39.77,38.1 38.66,38.1 37.54,38.1 36.43,38.1 35.32,39.21 40.88,39.21 39.77,39.21 38.66,39.21 37.54,39.21 36.43,39.21 35.32,40.24 40.88,40.24 39.77,40.24 38.66,40.24 37.54,40.24 36.43,40.24 34.21,35.96 31.67,40.24 30.72,40.24 34.21,36.99 34.21,38.1 34.21,39.21 34.21,40.24 45.32,35.96 50.88,35.96 49.77,35.96 48.66,35.96 47.55,35.96 46.43,35.96 45.32,36.99 50.88,36.99 49.77,36.99 48.66,36.99 47.55,36.99 46.43,36.99 45.32,38.1 50.88,38.1 49.77,38.1 48.66,38.1 47.55,38.1 46.43,38.1 45.32,39.21 50.88,39.21 49.77,39.21 48.66,39.21 47.55,39.21 46.43,39.21 45.32,40.24 50.88,40.24 49.77,40.24 48.66,40.24 47.55,40.24 46.43,40.24 44.21,35.96 43.1,35.96 41.99,35.96 44.21,36.99 43.1,36.99 41.99,36.99 44.21,38.1 43.1,38.1 41.99,38.1 44.21,39.21 43.1,39.21 41.99,39.21 44.21,40.24 43.1,40.24 41.99,40.24 32.62,40.24 31.67,39.29 30.72,39.29 32.62,39.29 31.67,38.34 30.72,38.34 32.62,38.34
  pour Top (isolate 0.305, no thermals): 34.45,40.64 51.44,40.64 51.44,34.29 30.96,34.29 29.37,35.88 29.37,42.07 30.48,43.18 33.34,43.18 33.81,42.7 33.81,41.27
  pour Bottom (no thermals): 34.45,40.64 51.44,40.64 51.44,35.08 30.96,35.08 29.37,36.67 29.37,42.07 30.48,43.18 33.34,43.18 33.81,42.7 33.81,41.27
+3V3
  Bottom 0.305: IC3.17 93.25,18.64
  Bottom 0.406: 93.25,18.64 C15.1
+5V  (via drill 0.3 pad 0.7)
  Top 0.406: IC2.6 37.37,11.82 36.67,12.52 C11.1 | IC2.4 37.2,13.42 36.67,12.88 C11.1 | IC2.18 48.83,11.02 49.37,10.48 v49.37,9.84 49.37,9.53 49.69,9.21 C17.1 | TEMP2.1 32.07,28.79 32.07,27.3 35.56,23.81 35.56,14.61 36.67,13.5 C11.1 | v61.75,16.03 I2C2.1 59.83,22.72 58.42,24.13 v58.42,27.78 | v80.96,10.16 v80.96,13.18 79.06,13.18 78.27,13.97 C22.1 78.27,18.39 C21.1 v76.68,18.41 69.85,18.41 68.9,17.46 SG2.+ | v33.34,6.83 33.34,9.37 34.61,10.64 36.04,10.64 36.67,11.27 C11.1 | TEMP1.1 22.97,27.99 23.5,27.46 30.75,27.46 TEMP2.1 | OLED1.1 39.21,28.89 37.31,26.99 33.81,26.99 32.17,28.63 TEMP2.1
  Bottom 0.254: TP7.TP 18.26,22.7 | 18.26,22.7 18.26,25.08 19.68,26.51 C25.1 | R23.2 18.42,22.54 18.26,22.7
  Bottom 0.305: IC3.20 93.32,16.69 | IC3.4 81.23,13.44 v80.96,13.18 | 32.07,28.79 TEMP2.1
  Bottom 0.406: IC3.20 87.18,16.69 86.52,16.03 86.52,13.97 85.99,13.44 IC3.4 | v49.37,9.84 52.23,9.84 53.5,11.11 53.5,14.13 54.13,14.76 R28.2 54.77,15.72 55.24,16.19 61.44,16.19 v61.75,16.03 61.91,16.03 62.23,16.19 64.93,16.19 67.15,13.97 SG2.+ R20.2 | 22.86,28.79 22.86,28.57 | 22.86,28.57 R33.2 | C23.1 63.96,22.72 I2C2.1 | C25.1 20.8,27.94 21.75,28.89 TEMP1.1 22.97,28.68 22.86,28.57 | C24.1 32.07,28.79 | C8.1 42.18,29.05 OLED1.1 42.34,28.15 43.18,27.3 45.09,27.3 45.4,27.62 46.35,27.62 46.67,27.3 57.94,27.3 v58.42,27.78 | 93.32,16.69 C2.1 | v80.96,10.16 80.96,9.09 TX.A RX.A 81.01,5.19 R21.2 R22.2 | D2.C 76.2,18.89 v76.68,18.41 | 37.7,1.83 U$5.VCC 37.39,2.14 C10.1 35.4,4.76 v33.34,6.83
+5V/1  (via drill 0.3 pad 0.7)
  Top 0.305: C7.+ v82.87,47.94
  Top 0.406: TP3.TP 90.17,45.09 87.31,47.94 C7.+
  Bottom 0.254: 26.19,47.62 26.19,48 | 26.19,48 U1.1 | 26.19,48 28.48,48 29.53,49.05 U1.8
  Bottom 0.305: v82.87,47.94 83.81,47 F1.1 | F1.1 R12.1 | R7.2 71.77,41.43 I2C1.1 71.44,41.1 68.41,41.1 66.36,39.05 66.36,35.88 65.56,35.08 27.62,35.08 26.83,35.88 26.83,45.88 C1.1 25.24,46.51 24.23,47.52 U2.3 22.21,49.06 C13.1 | R6.2 74.61,35.88 75.09,36.35 75.09,41.12 74.77,41.43 R7.2 | R7.2 76.36,41.43 77.79,42.86 83.19,42.86 83.82,43.5 F1.1
  Bottom 0.4: C1.1 26.2,47.62 26.19,47.62
+12V  (via drill 0.3 pad 0.7)
  Top 0.254: v5.56,33.81 TP1.TP
  Top 0.305: C6.+ 83.68,57.94 v81.76,57.94 | v56.67,40.32 53.02,40.32 52.55,39.85 52.55,34.29 52.07,33.81 9.21,33.81 8.1,34.92 8.1,44.29 9.84,46.04 9.84,49.05 v9.53,49.37
  Bottom 0.254: v9.53,49.37 10.16,48.74 10.16,45.72 7.94,43.5 7.94,35.24 6.51,33.81 v5.56,33.81
  Bottom 0.305: LM2940SX-12.3 81.7,58 v81.76,57.94 81.76,50.64 | 81.76,50.64 80.23,49.11 IC1.1 77.25,50.8 63.5,50.8 61.28,48.58 61.28,46.83 61.28,45.72 R15.2 | 81.76,50.64 83.19,49.21 87.47,49.21 88.11,48.58 88.11,47.15 90.48,44.77 R16.2 | R15.2 59.22,40.32 v56.67,40.32 | R15.2 61.28,37.62 R2.2 | v9.53,49.37 R3.2
ALERT_MC  (via drill 0.3 pad 0.7)
  Top 0.305: v38.26,17.62 38.26,17.94
  Top 0.406: IC2.1 38.26,16.61 38.26,17.94 38.26,22.86 v40.16,24.77
  Bottom 0.406: v40.16,24.77 40.8,24.77 42.55,23.02 50.01,23.02 53.66,19.37 68.58,19.37 69.37,20.16 SIG2.1 71.58,22.72 C14.1 | R33.1 22.86,19.21 24.45,17.62 v38.26,17.62
ALERT_PWR  (via drill 0.3 pad 0.7)
  Top 0.305: C12.1 79.28,41.19 SIG1.1 | v28.42,49.21 27.78,48.58 24.29,48.58 23.65,47.94 v23.65,41.27
  Bottom 0.254: U1.2 27.8,48.55 v28.42,49.21
  Bottom 0.305: SIG1.1 79.2,41.27 77.63,41.27 76.83,40.48 76.83,34.13 75.88,33.18 25.4,33.18 23.81,34.77 23.81,41.12 v23.65,41.27
AREF
  Top 0.406: IC2.20 50.24,12.62 C9.1
BUZZER  (via drill 0.3 pad 0.7)
  Top 0.406: IC2.14 44.54,10.09 v44.61,10.16
  Bottom 0.406: T3.1 56.36,10.79 55.72,10.16 55.72,9.37 55.09,8.73 46.04,8.73 v44.61,10.16
DBG1  (via drill 0.3 pad 0.7)
  Top 0.406: IC2.23 48.83,15.02 49.37,15.56 v49.37,18.89 | v28.42,18.73 27.3,17.62 JP3.1
  Bottom 0.406: v49.37,18.89 49.21,18.73 v28.42,18.73 | R11.2 26.83,13.49 JP3.1
DBG2  (via drill 0.3 pad 0.7)
  Top 0.406: v29.53,20 29.84,19.68 29.84,12.22 29.05,11.43 JP3.2 | IC2.24 47.79,19.21 v48.26,19.68
  Bottom 0.406: v48.26,19.68 29.84,19.68 v29.53,20 | R19.2 27.15,11.27 JP3.2
DBG3  (via drill 0.3 pad 0.7)
  Top 0.406: IC2.25 46.14,15.82 v45.09,14.76 | v24.13,14.45 24.13,10 25.24,8.89 JP3.3
  Bottom 0.406: v45.09,14.76 38.1,14.76 37.15,15.72 25.4,15.72 v24.13,14.45 | R29.2 27.15,9.05 JP3.3
DBG4  (via drill 0.3 pad 0.7)
  Top 0.406: IC2.26 45.34,16.29 44.77,15.72 v44.13,15.72 | v22.7,14.45 22.7,8.26 24.61,6.35 JP3.4
  Bottom 0.406: v44.13,15.72 38.42,15.72 37.47,16.67 24.77,16.67 22.7,14.61 v22.7,14.45 | R30.2 26.83,6.83 JP3.4
GATE_1_MC  (via drill 0.3 pad 0.7)
  Top 0.406: v64.93,9.53 65.56,10.16 65.56,25.4 66.83,26.67 69.48,26.67 SIG2.3 | v39.21,7.3 39.27,7.3 IC2.9
  Bottom 0.406: v64.93,9.53 64.29,8.89 61.59,8.89 58.74,6.03 43.81,6.03 42.86,5.08 40.8,5.08 39.53,6.35 39.53,6.99 v39.21,7.3
GATE_1_PWR
  Top 0.305: SIG1.3 77.42,37.26 76.83,36.67 76.83,34.13 75.88,33.18 57.39,33.18 T2.1
GATE_2_MC  (via drill 0.3 pad 0.7)
  Top 0.406: SIG2.4 69.52,28.73 66.99,28.73 64.45,26.19 64.45,10.95 v63.66,10.16 | IC2.10 41.27,8.66 41.27,7.46 v40.64,6.83
  Bottom 0.406: v63.66,10.16 61.75,10.16 58.42,6.83 43.34,6.83 42.39,5.87 41.43,5.87 40.64,6.67 v40.64,6.83
GATE_2_PWR
  Bottom 0.305: SIG1.4 81.3,35.26 T1.1
GND  (via drill 0.3 pad 0.7)
  other vias: 90.01,21.11 93.58,17.7 92.87,26.04 86.2,28.57 89.38,28.57 37.54,9.37 59.53,29.21 63.98,28.1 72.71,29.53 31.91,8.57 54.93,1.67 29.53,24.45 38.66,26.83 46.04,28.89 87.79,28.57 82.39,25.88 40.64,12.7 42.07,12.7 40.8,10.48 24.61,22.38 30.72,23.18 26.59,20.64 18.41,28.1 61.44,11.67 63.18,15 49.61,13.49 51.12,16.99 50.4,17.7 59.85,15.24 63.18,12.54 56.99,29.21 19.29,4.68 13.57,4.68 7.38,4.68 15.16,15.48 38.1,29.77 28.89,28.89 29.53,26.27 71.12,1.98 87.63,15.64 91.28,10 94.14,13.02 93.19,13.02 89.14,18.02 86.84,12.22 76.99,6.27 72.87,19.84 70.64,19.84 74.93,15.95 81.12,17.62 81.12,19.05 80.17,15.72 72.71,27.94 76.99,27.3 80.17,28.26 18.41,29.21 18.41,26.99 33.18,20.88 29.37,7.62 82.63,10.4 86.28,19.29 86.28,18.02 86.2,10.95 87.79,18.02 93.27,11.67 91.44,21.11 30,28.89 60.17,10.87 72.71,26.43 66.99,25.16 56.67,22.94 63.02,21.35 91.12,8.33 22.7,16.83 19.21,24.45 21.11,15.56 38.34,24.45 41.67,26.99 56.67,24.37 31.91,6.99 34.69,7.22 31.91,5.4 39.29,3.02 30.64,1.43 29.37,1.43 48.74,1.67 74.93,1.98 76.99,8.65 68.58,8.97 63.9,7.86 65.25,7.86 52.07,1.67 82.87,2.46 82.87,3.41 47.15,28.89 58.26,29.21 42.55,10.48 68.58,10.72 74.77,23.34 73.98,12.14 73.98,13.41 21.83,22.38 20.8,17.46 33.18,13.02 33.18,12.06 35.32,6.59 43.34,12.7 44.61,12.7 45.88,12.7
  pour Top (isolate 0.305): 0,0 100.01,0 100,30.79 0,30.79
  pour Bottom (isolate 0.305): 0,0 100,0 100,30.79 0,30.79
GNDA  (via drill 0.3 pad 0.7)
  Bottom 0.254: 30.48,57.47 X2.2 | 46.81,56.28 U$3.P$2 | 26.99,49.05 U1.3 24.05,49.05 v23.34,49.45
  Bottom 0.406: U$2.P$2 30.48,57.47 | X3.2 46.81,56.28
  other vias: 32.23,55.24 27.78,58.58 27.78,56.83 17.46,58.58 32.15,58.58 32.15,56.83 43.97,56.67 45.72,59.05 48.58,59.05 43.74,52.55 21.27,46.35 87,60.17 93.66,60.17 88.11,60.17 89.22,60.17 90.33,60.17 91.44,60.17 92.55,60.17 87,59.05 93.66,59.05 88.11,59.05 89.22,59.05 90.33,59.05 91.44,59.05 92.55,59.05 93.66,57.94 88.11,57.94 89.22,57.94 90.33,57.94 91.44,57.94 92.55,57.94 93.66,55.09 88.11,55.09 89.22,55.09 90.33,55.09 91.44,55.09 92.55,55.09 89.22,56.52 90.33,56.52 92.55,56.52 91.52,56.52 93.66,56.52 88.11,56.52 87,53.98 93.66,53.98 88.11,53.98 89.22,53.98 90.33,53.98 91.44,53.98 92.55,53.98 93.66,52.86 88.11,52.86 89.22,52.86 90.33,52.86 91.44,52.86 92.55,52.86 87,52.86 87,51.75 93.66,51.75 88.11,51.75 89.22,51.75 90.33,51.75 91.44,51.75 92.55,51.75 87,50.64 93.66,50.64 88.11,50.64 89.22,50.64 90.33,50.64 91.44,50.64 92.55,50.64 92.71,49.37 89.38,49.37 90.49,49.37 91.6,49.37 92.23,47.94 90.01,47.94 91.12,47.94 21.51,43.81 29.53,46.75 28.34,44.13 18.1,53.98 18.1,47.62 18.1,46.35 18.1,45.09 17.3,55.4 24.53,45.8 77.63,55.4 78.9,55.4 80.17,55.4 71.12,59.85 61.44,58.26 70.01,54.77 55.88,54.29 67.15,42.39 69.06,34.45 69.53,35.88 75.56,34.92 83.03,34.77 86.84,34.77 90.33,34.77 92.23,42.86 79.22,47.31 69.14,48.97 70.25,48.97 71.36,48.97 72.47,48.97 70.25,47.86 71.36,47.86 72.47,47.86 69.14,47.86 69.14,46.75 70.25,46.75 71.36,46.75 72.47,46.75 69.14,45.64 70.25,45.64 71.36,45.64 72.47,45.64 73.58,48.97 73.58,47.86 73.58,46.75 73.58,45.64 69.14,44.53 70.25,44.53 71.36,44.53 72.47,44.53 73.58,44.53 75.64,48.82 75.64,46.75 75.64,44.85 59.21,48.26 56.52,46.2 43.97,44.13 32.07,44.61 28.1,41.59 28.1,37.78 20.95,40.01 1.51,47.62 1.51,45.4 1.51,49.85 8.33,58.98 9.68,58.98 10.48,58.1 10.48,56.91 7.54,58.18 7.46,56.99 8.18,56.12 9.68,56.04 44.77,52.55 23.18,58.58 21.91,57.15 19.21,60.33 38.73,59.05 55.88,56.36 61.12,51.28 68.42,53.34 70.8,57.31 69.85,60.8 83.98,53.82 83.98,51.44 63.02,48.1 63.02,46.2 62.79,40.4 60.17,39.93 73.74,34.29 84.45,39.69 87.15,40.8 90.41,40.16 18.34,36.75 1.51,40.72 1.51,37.94 1.51,43.1
  pour Top (isolate 0.305, rank 6): 0,62 100,62 100.01,32.07 0,32.07
  pour Bottom (isolate 0.305, rank 6): 0,62 100,62 100.01,32.07 0,32.07
JBC_1_SLEEP  (via drill 0.3 pad 0.7)
  Top 0.406: IC2.12 42.94,4.52 v42.55,4.13 | v77.31,4.45 86.36,4.45 88.11,6.19 89.65,6.19 SLEEP.1
  Bottom 0.406: v42.55,4.13 43.02,4.13 44.13,5.24 60.17,5.24 60.48,4.92 76.83,4.92 v77.31,4.45 | R22.1 | SLEEP.1 88.31,6.24 87,4.92 R22.1 | C26.1 R22.1
JBC_1_TEMP_ADC  (via drill 0.3 pad 0.7)
  Top 0.406: v44.13,11.27 45.88,11.27 46.42,11.82 IC2.19 50.41,11.82 C19.1 | v26.99,23.34 28.26,23.34 30.96,20.64 v30.96,12.22
  Bottom 0.406: R27.1 R4.1 v26.99,23.34 | v44.13,11.27 43.66,11.75 40.01,11.75 39.05,10.79 32.38,10.79 v30.96,12.22
JBC_2_SLEEP  (via drill 0.3 pad 0.7)
  Top 0.406: v44.29,3.97 43.74,4.52 IC2.13
  Bottom 0.406: v44.29,3.97 44.77,4.45 59.53,4.45 59.85,4.13 75.09,4.13 76.36,2.86 C27.1 R21.1 79.38,1.9 79.85,1.43 88.27,1.43 89.69,2.86 SLEEP.2
JBC_2_TEMP_ADC  (via drill 0.3 pad 0.7)
  Top 0.406: v45.88,13.97 46.13,14.22 IC2.22 49.3,14.22 50.48,15.4 C20.1 | v34.13,23.5 34.45,23.18 34.45,20.48 33.02,19.05 33.02,14.61 v33.18,14.45
  Bottom 0.406: R5.1 R32.1 v34.13,23.5 | v33.18,14.45 33.5,14.76 36.67,14.76 37.62,13.81 45.56,13.81 v45.88,13.97
MISO
  Top 0.406: IC2.16 46.2,8.67 46.2,3.17 45.09,2.06 43.81,2.06 42.7,0.95 38.42,0.95 U$5.MISO 38.1,2.06
MOSI  (via drill 0.3 pad 0.7)
  Top 0.406: IC2.15 45.34,3.59 44.77,3.02 43.5,3.02 | OLED2.2 50.91,24.97 56.67,19.21 v56.67,3.49 | 43.5,3.02 41.91,3.02 39.69,5.24 34.61,5.24 34.13,4.76 v34.13,4.45 | v43.5,3.17 43.5,3.02
  Bottom 0.406: v56.67,3.49 56.52,3.65 45.4,3.65 44.77,3.02 43.5,3.02 v43.5,3.17 | U$5.MOSI 35.24,3.33 v34.13,4.45
N$2  (via drill 0.3 pad 0.7)
  Top 0.305: Q6.4 35.08,43.02 v33.97,44.13 | v41.12,44.13 40.21,44.13 Q5.4 | IC5.4 59.05,36.35 v59.69,36.99
  Bottom 0.305: v33.97,44.13 v41.12,44.13 42.7,42.55 52.55,42.55 54.93,40.16 54.93,38.42 56.36,36.99 58.1,36.99 58.26,36.99 v59.69,36.99
N$3
  Bottom 0.305: R3.1 7.62,48.78 LED1.2
N$4
  Top 0.305: IC5.2 60.33,38.89 59.05,37.62 54.45,37.62 53.58,36.75 T2.3 53.58,34.21 52.55,33.18 8.89,33.18 7.46,34.61 7.46,45.24 7.94,45.72 LED1.1
N$5  (via drill 0.3 pad 0.7)
  Top 0.305: IC5.1 64.29,36.99 v63.5,36.99
  Bottom 0.305: v63.5,36.99 R2.1
N$6
  Top 0.406: X4.1 37.86,11.02 IC2.7
N$7  (via drill 0.3 pad 0.7)
  Top 0.305: Q2.4 47.31,43.02 v46.35,43.97 | Q1.4 52.44,43.97 52.44,43.92 53.13,43.92 v53.34,43.97 | v59.37,42.39 IC4.4
  Bottom 0.305: v46.35,43.97 v53.34,43.97 56.04,43.97 57.63,42.39 v59.37,42.39
N$8  (via drill 0.3 pad 0.7)
  Top 2.54: 38.1,49.37 38.1,48.14 Q5.5
  Top 5: X2.3 35.54,51.93 38.1,49.37
  other vias: 39.45,50.72 33.89,50.72 35,50.72 36.12,50.72 37.23,50.72 38.34,50.72 39.45,49.61 33.89,49.61 35,49.61 36.12,49.61 37.23,49.61 38.34,49.61 39.45,48.5 33.89,48.5 35,48.5 36.12,48.5 37.23,48.5 38.34,48.5 39.45,47.39 33.89,47.39 35,47.39 36.12,47.39 37.23,47.39 38.34,47.39 39.45,46.28 33.89,46.28 35,46.28 36.12,46.28 37.23,46.28 38.34,46.28 40.56,50.72 41.67,50.72 42.78,50.72 40.56,49.61 41.67,49.61 42.78,49.61 40.56,48.5 41.67,48.5 42.78,48.5 40.56,47.39 41.67,47.39 42.78,47.39 40.56,46.28 41.67,46.28 42.78,46.28
  pour Top (isolate 0.305, no thermals): 33.34,45.72 33.34,51.28 43.66,51.28 43.66,45.72
  pour Bottom (isolate 0.305, rank 2, no thermals): 33.34,45.72 33.34,51.28 43.66,51.28 43.66,45.72
N$9  (via drill 0.3 pad 0.7)
  Top 0.305: OK1.1 58.58,50.8 v59.05,51.28
  Bottom 0.305: v59.05,51.28 R10.2
N$10  (via drill 0.3 pad 0.7)
  Top 2.54: 50.72,49.53 50.72,48.06 Q1.5
  Top 5: X3.3 51.89,50.7 50.72,49.53
  other vias: 51.04,50.72 45.48,50.72 46.59,50.72 47.7,50.72 48.82,50.72 49.93,50.72 51.04,49.61 45.48,49.61 46.59,49.61 47.7,49.61 48.82,49.61 49.93,49.61 51.04,48.5 45.48,48.5 46.59,48.5 47.7,48.5 48.82,48.5 49.93,48.5 51.04,47.39 45.48,47.39 46.59,47.39 47.7,47.39 48.82,47.39 49.93,47.39 51.04,46.28 45.48,46.28 46.59,46.28 47.7,46.28 48.82,46.28 49.93,46.28 52.15,50.72 53.26,50.72 54.37,50.72 52.15,49.61 53.26,49.61 54.37,49.61 52.15,48.5 53.26,48.5 54.37,48.5 52.15,47.39 53.26,47.39 54.37,47.39 52.15,46.28 53.26,46.28 54.37,46.28
  pour Top (isolate 0.305, no thermals): 44.93,45.72 44.93,51.28 54.93,51.28 54.93,45.72
  pour Bottom (isolate 0.305, no thermals): 44.93,45.72 44.93,51.28 54.93,51.28 54.93,45.72
N$11
  Bottom 0.4: 24.29,56.41 24.29,56.4 R18.1
  Bottom 0.406: 24.29,56.41 X2.1 26.51,56.36 R9.2
N$12  (via drill 0.3 pad 0.7)
  Top 0.406: TP2.TP 75.72,60.48 v75.25,60.01
  Bottom 0.4: D1.C 72.56,55.52 F4.2
  other vias: 73.82,59.21 75.72,59.21 74.77,59.21 74.77,57.78 74.77,56.36 73.82,56.36 75.72,56.36 75.72,57.78 73.82,57.78 74.3,58.5 74.3,57.07 75.25,57.07 75.25,58.5 74.3,60.01
  pour Bottom (isolate 0.305): 73.5,60.33 73.5,56.04 76.04,56.04 76.04,60.33
  pour Top (isolate 0.305, no thermals): 73.5,60.33 73.5,56.04 76.04,56.04 76.04,60.33
N$13
  Bottom 0.254: 41.73,54.9 R17.1
  Bottom 0.406: X3.1 41.73,54.9 | R8.2 41.52,54.69 R17.1
N$14  (via drill 0.3 pad 0.7)
  Top 0.305: v40.01,42.23 38.94,42.23 Q6.1 | v53.66,38.89 IC5.3
  Bottom 0.305: v40.01,42.23 40.8,41.43 52.07,41.43 53.66,39.85 v53.66,38.89
  pour Top (no thermals): 36.2,44.93 36.2,41.43 39.05,41.43 39.05,44.93
N$15
  Top 0.305: Q1.3 51.12,42.55 55.09,42.55 57.47,44.93 IC4.3
  pour Top (no thermals): 48.42,44.85 48.42,41.43 51.28,41.43 51.28,44.85
N$17
  Top 0.305: LED2.1 88.38,37.62 86.84,37.62 86.04,38.42 86.04,42.7 85.41,43.34 78.11,43.34 77.47,42.7 73.34,42.7 72.71,43.34 68.42,43.34 66.83,44.93 IC4.2
  Bottom 0.305: T1.3 88.31,37.47 LED2.1
N$18  (via drill 0.3 pad 0.7)
  Top 0.305: IC4.1 v63.34,42.39
  Bottom 0.305: v63.34,42.39 R15.1
N$19
  Top 0.406: X4.3 39.05,9.37 39.05,10.06 IC2.8
N$20
  Bottom 0.305: LED2.2 88.58,39.74 R16.1
N$21  (via drill 0.3 pad 0.7)
  other vias: 11.83,43.34 13.41,58.82 14.84,58.82 15.48,58.02 15.48,56.91 12.7,58.02 12.7,56.91 13.34,56.12 14.76,56.12 10.87,42.86 10.56,41.59 11.03,40.64 12.14,40.32 13.1,40.32 14.05,40.32 14.84,40.8 15.16,41.75 14.84,42.86 13.89,43.34 12.94,43.34 11.35,38.1 12.54,38.26 13.81,38.26 14.84,37.86 15.24,36.91 14.37,35.48 10.64,37.39 10.64,36.27 11.27,35.48 12.3,35.4 13.34,35.4 15.08,36.04
  pour Top (isolate 0.305, no thermals): 12.22,58.42 12.22,45.4 9.68,42.86 9.68,35.88 10.48,35.08 14.76,35.08 16.03,36.35 16.03,58.42 15.08,59.37 13.18,59.37
  pour Bottom (isolate 0.305, no thermals): 12.22,58.42 12.22,45.4 9.68,42.86 9.68,35.88 10.48,35.08 14.76,35.08 16.03,36.35 16.03,58.42 15.08,59.37 13.18,59.37
N$23
  Bottom 0.4: D6.C R10.1
N$24
  Bottom 0.406: JP2.2 72.55,7.94 C18.2
N$25
  Bottom 0.305: IC3.2 75.64,12.14 74.77,11.27
  Bottom 0.406: 74.45,10.16 C18.1 74.45,10.95 74.77,11.27
N$26
  Bottom 0.305: F1.2 80.91,44.55 IC1.2
N$27
  Bottom 0.254: R23.1 20.32,20.75 DBG5.A
N$29
  Bottom 0.406: IC3.23 89.83,14.74 89.38,14.29 89.38,8.73 87.63,6.99 R25.1
N$30
  Bottom 0.406: IC3.22 88.89,15.39 88.42,14.92 88.42,10 87.47,9.05 R26.1
N$31
  Bottom 0.406: RX.C R25.2
N$32
  Bottom 0.406: F2.1 80.01,22.23 81.28,20.95 85.41,20.95 86.2,21.75 86.2,23.2 USB.VBUS
N$33
  Bottom 0.406: TX.C R26.2
N$35
  Bottom 0.406: R27.2 24.97,26.56 TEMP1.2
N$37
  Bottom 0.406: R31.2 R28.1 | 56.99,12.38 R31.2 | SG2.- 60.01,12.7 R31.2
N$38
  Bottom 0.406: DBG1.A R11.1
N$39
  Bottom 0.4: F4.1 75.47,52.79 LM2940SX-12.1
N$40
  Bottom 0.406: DBG2.A R19.1
N$41
  Bottom 0.406: DBG3.A R29.1
N$42
  Bottom 0.406: DBG4.A R30.1
N$46
  Bottom 0.406: T3.3 54.45,12.38 R31.1
N$47
  Bottom 0.406: R32.2 34.18,26.56 TEMP2.2
OLED_CS  (via drill 0.3 pad 0.7)
  Top 0.406: IC2.2 37.53,15.02 36.99,15.56 36.99,24.61 v38.1,25.72 | OLED2.3 52.91,25.19 v53.66,24.45
  Bottom 0.406: v38.1,25.72 45.09,25.72 45.24,25.56 52.55,25.56 v53.66,24.45
OLED_DC  (via drill 0.3 pad 0.7)
  Top 0.406: OLED2.4 54.91,22.56 58.9,18.57 v58.9,8.89 | v41.91,6.83 42.14,7.05 IC2.11
  Bottom 0.406: v58.9,8.89 57.78,7.78 42.86,7.78 v41.91,6.83
RESET  (via drill 0.3 pad 0.7)
  Top 0.406: v41.27,22.86 42.94,21.19 42.94,19.76 IC2.29 | T6002.P$3 T6002.P$4 66.67,8.36 66.67,17.94 v66.99,18.26 | JP1.2 31.59,2.86 U$5.RST | v30.64,9.37 31.91,10.64 31.91,21.91 v31.75,22.07
  Bottom 0.406: v31.75,22.07 36.67,22.07 37.62,23.02 41.12,23.02 v41.27,22.86 41.91,22.23 49.69,22.23 53.34,18.57 66.67,18.57 v66.99,18.26 | R20.1 71.6,12.06 71.03,11.49 JP2.3 69.78,6.7 T6002.P$4 | v30.64,9.37 30.64,6.19 JP1.2
RX  (via drill 0.3 pad 0.7)
  Top 0.406: IC2.30 42.14,20.41 v40.48,22.07 | v76.2,10.79 v76.2,16.67
  Bottom 0.305: IC3.1 76.9,11.49 v76.2,10.79
  Bottom 0.406: v40.48,22.07 41.12,21.43 49.37,21.43 53.02,17.78 65.88,17.78 66.52,17.14 75.88,17.14 76.2,16.83 v76.2,16.67
SCK  (via drill 0.3 pad 0.7)
  Top 0.406: v47.47,2.7 47.47,7.78 | 47.47,7.78 47.47,10.05 IC2.17 | OLED2.1 48.91,25.38 55.72,18.57 55.72,8.1 54.45,6.83 48.42,6.83 47.47,7.78 | U$5.SCK 35.24,3.49 36.04,4.29 39.37,4.29 v41.75,1.91
  Bottom 0.406: v47.47,2.7 46.35,1.59 42.07,1.59 v41.75,1.91
SCL_MC  (via drill 0.3 pad 0.7)
  Top 0.406: IC2.28 43.74,24.53 v43.81,24.69
  Bottom 0.406: v43.81,24.69 50.72,24.69 54.45,20.95 59.21,20.95 59.85,21.59 59.85,23.65 60.96,24.77 61.01,24.72 I2C2.2
SCL_PWR  (via drill 0.3 pad 0.7)
  Top 0.305: v25.56,43.02 25.56,44.61 26.19,45.24 30.16,45.24 v30.48,44.93
  Bottom 0.305: R7.1 71.87,39.53 I2C1.2 71.44,39.1 68.63,39.1 67.15,37.62 67.15,35.56 66.04,34.45 26.51,34.45 25.56,35.4 25.56,42.86 | 25.56,42.86 24.61,43.81 22.86,43.81 22.21,44.46 U2.4 | 25.56,42.86 v25.56,43.02 | v30.48,44.93 30.48,47.94 U1.10
SDA_MC  (via drill 0.3 pad 0.7)
  Top 0.406: IC2.27 44.54,23.43 45.88,24.77 v45.88,26.51
  Bottom 0.406: v45.88,26.51 46.12,26.43 61.47,26.43 I2C2.3
SDA_PWR  (via drill 0.3 pad 0.7)
  Top 0.305: v31.91,48.58 31.91,46.83 30.96,45.88 25.88,45.88 24.61,44.61 v24.61,42.23
  Bottom 0.254: 31.27,48.58 31.25,48.55 U1.9
  Bottom 0.305: R6.1 72.34,37.78 I2C1.3 71.44,37.1 68.69,37.1 67.94,36.51 67.94,35.24 66.52,33.81 25.88,33.81 24.61,35.08 24.61,42.07 | 24.61,42.07 23.97,42.7 21.27,42.7 20.33,43.64 U2.6 | 24.61,42.07 v24.61,42.23
  Bottom 0.4: v31.91,48.58 31.27,48.58
TC_1_N  (via drill 0.3 pad 0.7)
  Top 0.4: v20,55.4 v28.42,55.4
  Bottom 0.152: 28.41,53.82 R9.1
  Bottom 0.254: U1.5 26.14,50.59 26.35,50.8 28.1,50.8 28.42,51.12 C5.2
  Bottom 0.4: 20.25,54.28 20,54.37 v20,55.4 | v28.42,55.4 28.41,53.82 C5.2 | U$2.P$1 30.48,55.4 29.21,54.13 R9.1
  Bottom 0.406: D9.1 20.25,54.28 D9.2
TC_1_P
  Bottom 0.254: U1.4 25.06,49.55 24.29,50.32 R18.2
  Bottom 0.4: 21.44,51.92 23.82,51.92 R18.2 24.61,52.07 C5.1
  Bottom 0.406: D9.3 21.44,51.92
TC_2_N  (via drill 0.3 pad 0.7)
  Top 0.4: v31.75,50.64 v31.75,53.98
  Bottom 0.254: 47.62,55.34 C4.2 | U1.7 31.3,49.55 31.59,49.85
  Bottom 0.4: C4.2 49.38,54.77 D8.1 | 31.59,49.85 31.59,50.48 v31.75,50.64 | 35.72,53.98 38.26,56.52 39.29,56.52 R8.1
  Bottom 0.406: 47.62,55.34 U$3.P$1 46.83,56.04 45.88,56.04 45.24,56.67 45.24,57.94 43.97,59.21 40.64,59.21 39.37,57.94 R8.1 | D8.1 D8.2 | 35.72,53.98 v31.75,53.98
TC_2_P
  Bottom 0.152: 45.72,54.13 45.72,53.98
  Bottom 0.254: U1.6 30.37,51.01 30.48,51.12
  Bottom 0.4: R17.2 43.5,53.98 42.7,53.18 32.54,53.18 30.48,51.12 | 50.49,53.02 46.83,53.02 45.72,54.13
  Bottom 0.406: R17.2 C4.1 45.72,54.13 | 43.18,54.45 R17.2 | 50.49,53.02 D8.3 | R17.2
TX  (via drill 0.3 pad 0.7)
  Top 0.406: IC2.31 41.34,19.62 v40.32,20.64
  Bottom 0.305: 74.97,14.09 IC3.5
  Bottom 0.406: v40.32,20.64 49.05,20.64 52.7,16.99 65.56,16.99 66.2,16.35 72.71,16.35 74.97,14.09
USB+
  Bottom 0.305: IC3.15 88.96,19.94 87.79,21.11 USB.D+
USB-
  Bottom 0.305: IC3.16 88.18,19.29 87,20.48 USB.D-
  Bottom 0.406: USB.D-
V+
  Bottom 0.406: D2.A 79.92,25.33 F2.2
ZC_MC  (via drill 0.3 pad 0.7)
  Top 0.406: v42.39,24.77 41.75,24.77 39.21,22.23 39.21,19.53 40.54,18.2 IC2.32
  Bottom 0.406: v42.39,24.77 43.34,23.81 50.32,23.81 53.98,20.16 66.99,20.16 67.63,20.8 67.63,23.97 68.37,24.72 SIG2.2
ZC_PWR  (via drill 0.3 pad 0.7)
  Top 0.305: v87.95,45.88 87.79,46.04 82.55,46.04 80.96,47.62 80.96,49.53 78.9,51.59 68.74,51.59 67.94,50.8 OK1.4
  Bottom 0.305: SIG1.2 80.12,39.26 80.12,39.32 81.44,40.64 83.03,40.64 85.41,43.02 87.31,43.02 87.94,43.65 R12.2 v87.95,45.88

### Text on the board
tPlace: INRUSH | GND | VAC | PE->GND | NTC | PE | GND | 24VAC | 12VAC | TC1 | GND | JBC1 | TC2 | GND | JBC2 | PWR | 5V | LED1 | GND | GND | 12V | I2C | SIG | LED2 | T1 | T2 | SPI_OLED | I2C | SIG | SLEEP1 | SLEEP2 | 1
bPlace: FUSE | FUSE | FUSE | USB | PE | 5V | GND | SOLDERING / STATION / 05.2019 V4 | DBG1 | DBG2 | TX | SLEEP | DBG3 | RESET | SLEEP1 | DBG4 | ISP | RX | USB | | | dW | SLEEP2 | debugWIRE | GND